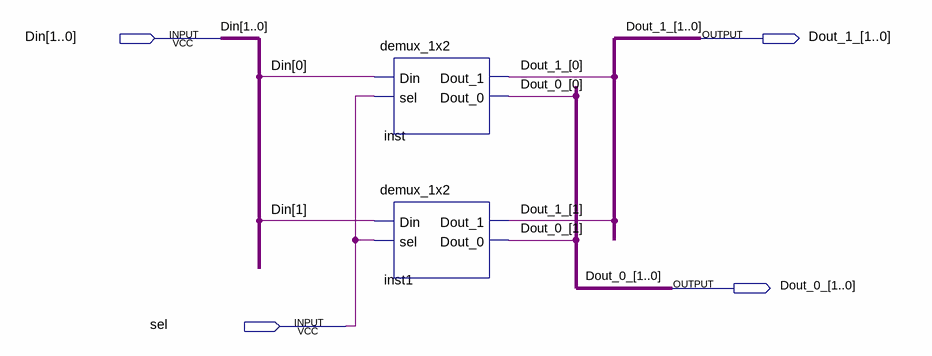
[diagram p0: schematic sheet]
// Quartus schematic demux_1x2_2bit.bdf as structural Verilog: 2 symbols, 4 pins
module demux_1x2_2bit (
  input  [1:0] Din,
  input  sel,
  output [1:0] Dout_1_,
  output [1:0] Dout_0_
);

  demux_1x2 inst (.Din(Din[0]), .sel(sel), .Dout_1(Dout_1_[0]), .Dout_0(Dout_0_[0]));
  demux_1x2 inst1 (.Din(Din[1]), .sel(sel), .Dout_1(Dout_1_[1]), .Dout_0(Dout_0_[1]));
endmodule
